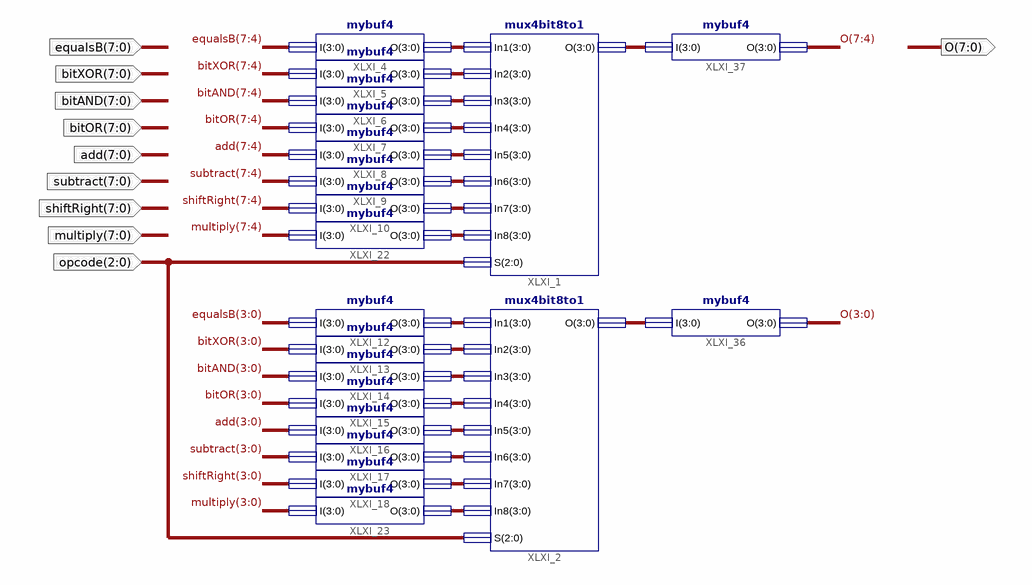
[diagram p0: schematic sheet 1]
// Xilinx ISE schematic mux8bit8to1.sch (spartan6) as structural Verilog: 20 symbols, 10 ports
module mux8bit8to1 (
  input  [2:0] opcode,
  input  [7:0] equalsB,
  input  [7:0] bitXOR,
  input  [7:0] bitAND,
  input  [7:0] bitOR,
  input  [7:0] multiply,
  input  [7:0] shiftRight,
  input  [7:0] subtract,
  input  [7:0] add,
  output [7:0] O
);

  wire [3:0] XLXN_52, XLXN_53, XLXN_54, XLXN_55, XLXN_56, XLXN_57, XLXN_58, XLXN_59, XLXN_137, XLXN_138,
       XLXN_139, XLXN_140, XLXN_141, XLXN_142, XLXN_143, XLXN_144, XLXN_147, XLXN_148;

  mux4bit8to1 XLXI_1 (
    .In1(XLXN_52), .In2(XLXN_53), .In3(XLXN_54), .In4(XLXN_55), .In5(XLXN_56), .In6(XLXN_57), .In7(XLXN_58),
    .In8(XLXN_59), .S(opcode), .O(XLXN_147));
  mux4bit8to1 XLXI_2 (
    .In1(XLXN_137), .In2(XLXN_138), .In3(XLXN_139), .In4(XLXN_140), .In5(XLXN_141), .In6(XLXN_142),
    .In7(XLXN_143), .In8(XLXN_144), .S(opcode), .O(XLXN_148));
  mybuf4 XLXI_12 (.I(equalsB[3:0]), .O(XLXN_137));
  mybuf4 XLXI_13 (.I(bitXOR[3:0]), .O(XLXN_138));
  mybuf4 XLXI_14 (.I(bitAND[3:0]), .O(XLXN_139));
  mybuf4 XLXI_4 (.I(equalsB[7:4]), .O(XLXN_52));
  mybuf4 XLXI_5 (.I(bitXOR[7:4]), .O(XLXN_53));
  mybuf4 XLXI_22 (.I(multiply[7:4]), .O(XLXN_59));
  mybuf4 XLXI_10 (.I(shiftRight[7:4]), .O(XLXN_58));
  mybuf4 XLXI_9 (.I(subtract[7:4]), .O(XLXN_57));
  mybuf4 XLXI_8 (.I(add[7:4]), .O(XLXN_56));
  mybuf4 XLXI_7 (.I(bitOR[7:4]), .O(XLXN_55));
  mybuf4 XLXI_6 (.I(bitAND[7:4]), .O(XLXN_54));
  mybuf4 XLXI_15 (.I(bitOR[3:0]), .O(XLXN_140));
  mybuf4 XLXI_16 (.I(add[3:0]), .O(XLXN_141));
  mybuf4 XLXI_17 (.I(subtract[3:0]), .O(XLXN_142));
  mybuf4 XLXI_18 (.I(shiftRight[3:0]), .O(XLXN_143));
  mybuf4 XLXI_23 (.I(multiply[3:0]), .O(XLXN_144));
  mybuf4 XLXI_36 (.I(XLXN_148), .O(O[3:0]));
  mybuf4 XLXI_37 (.I(XLXN_147), .O(O[7:4]));
endmodule
